# EasyEDA schematic Schematic_Transmitter.json
TITLE: Sheet_1; REV: 1.0; Date: 2023-10-30; Sheet: 1/1; Drawn By: sreenupalem; Company: Your Company
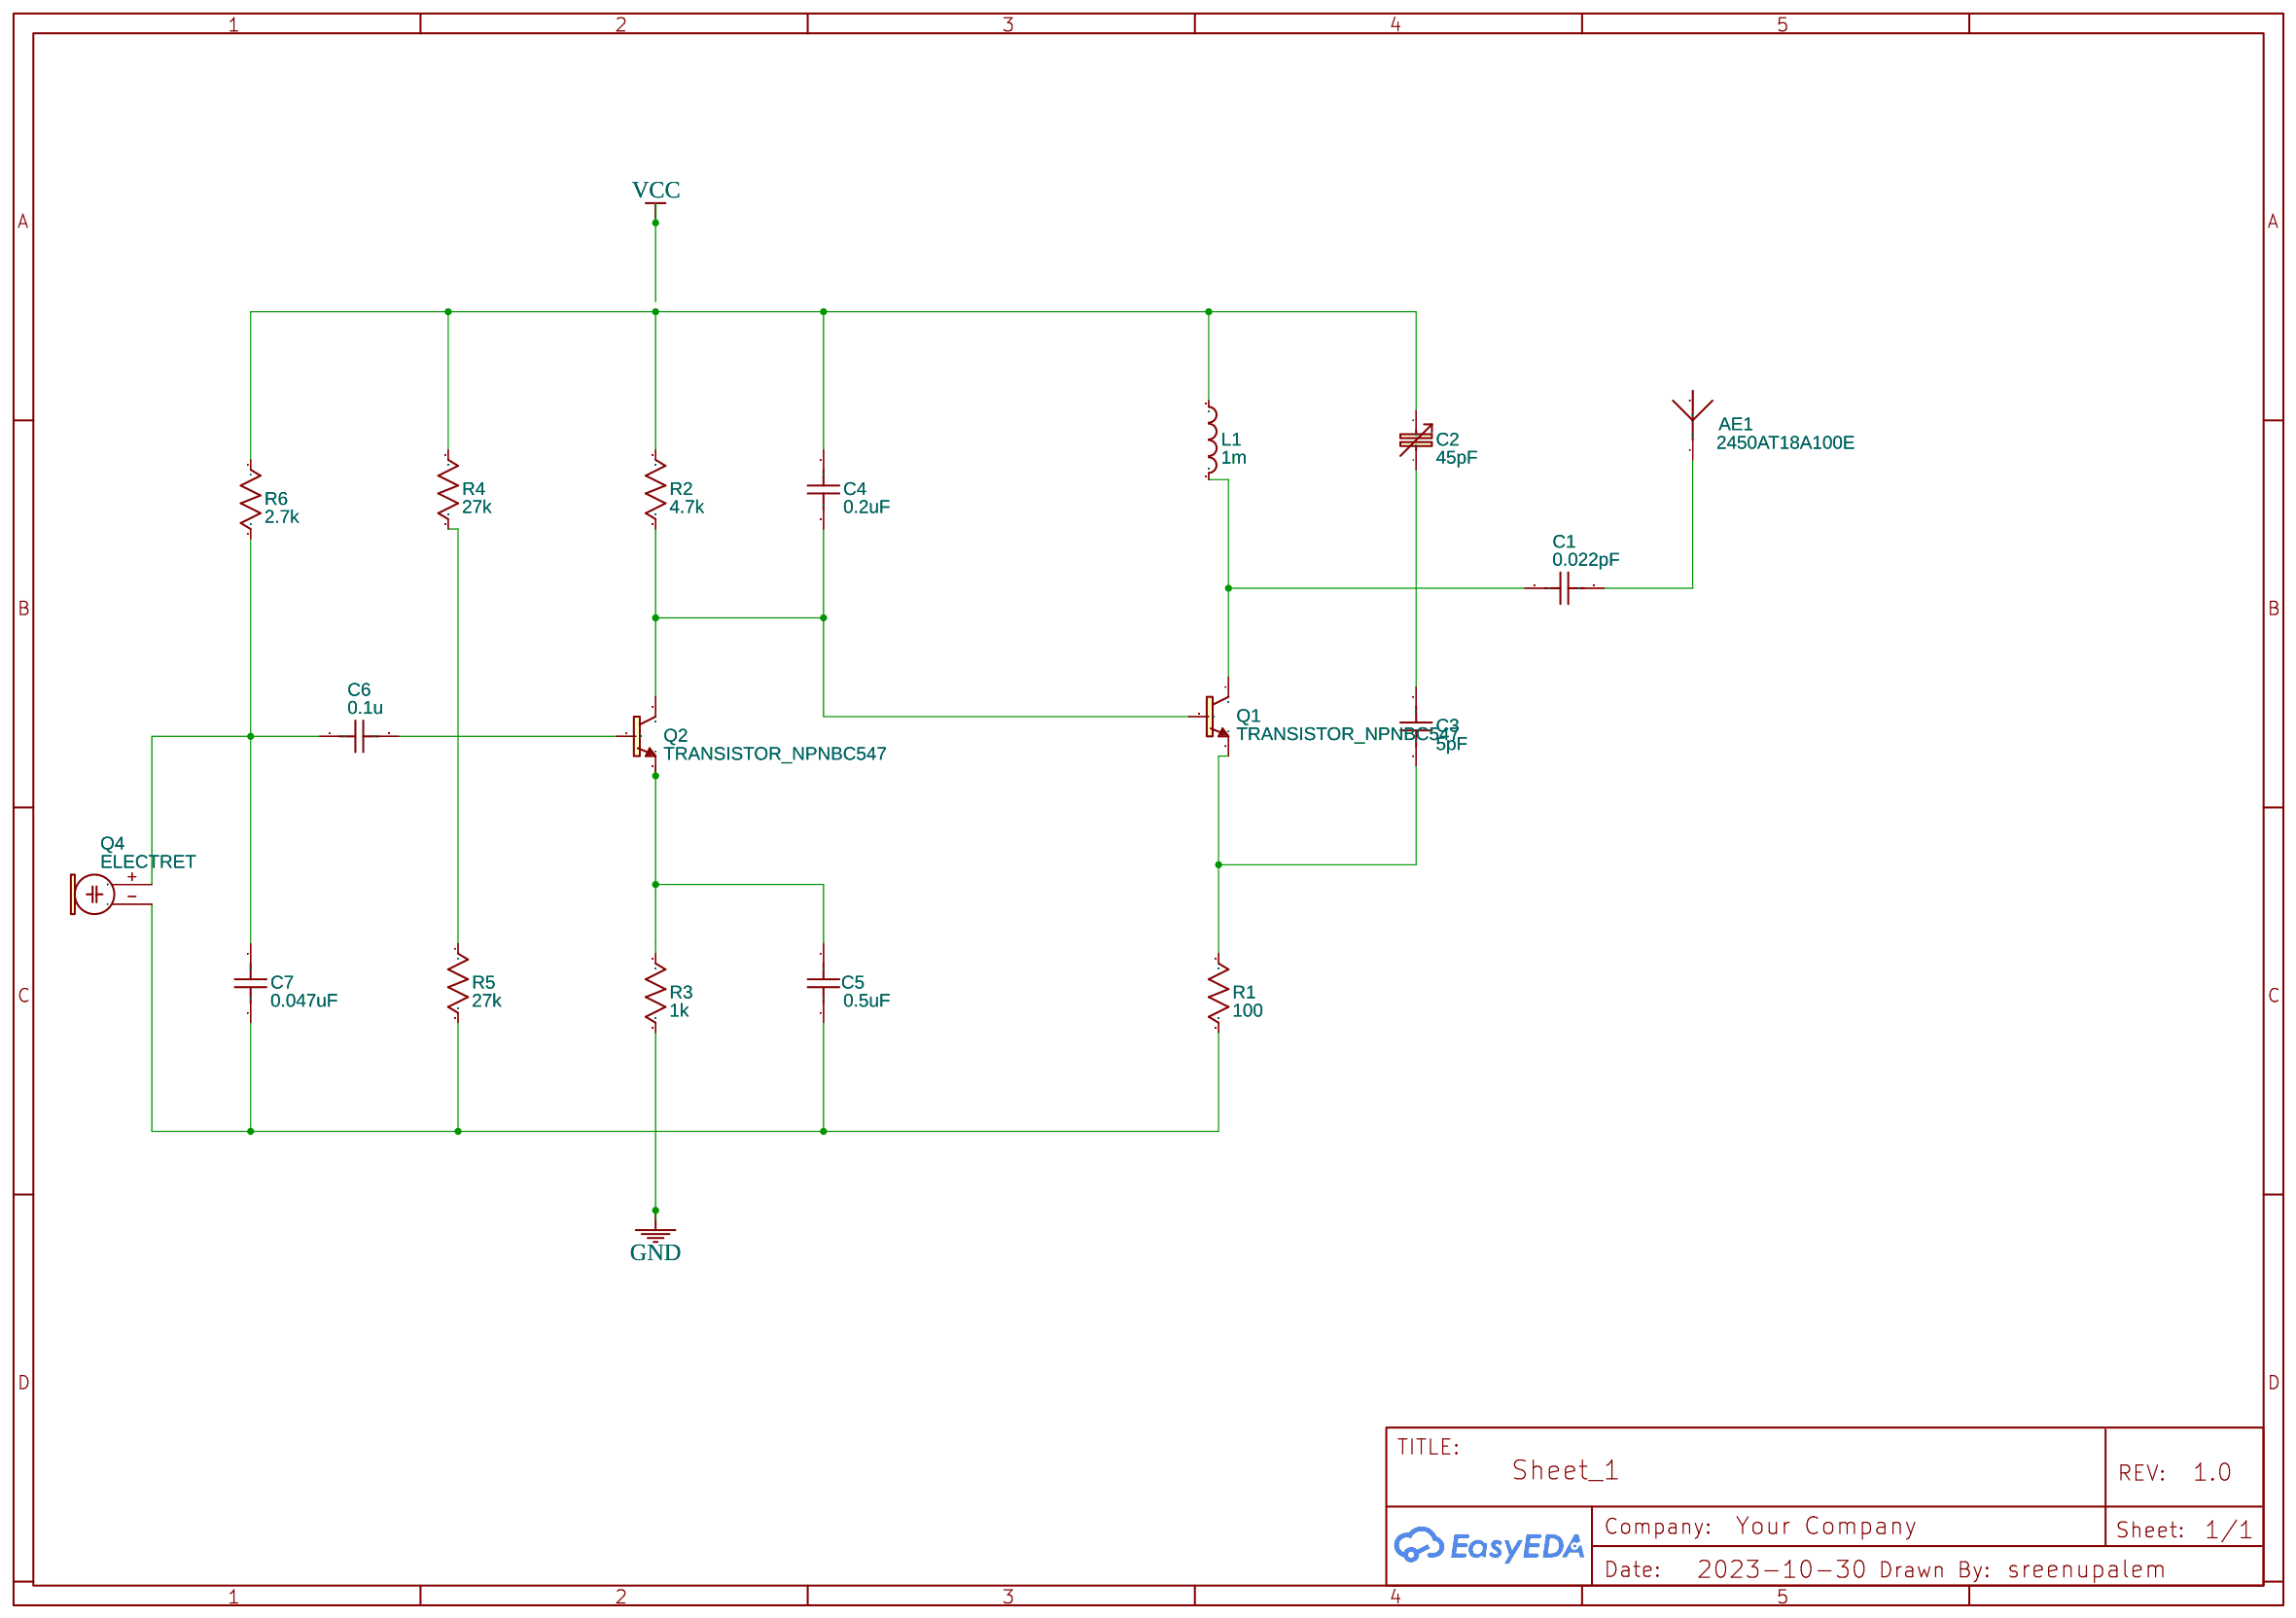
[diagram p0: schematic sheet]

## Parts
AE1  2450AT18A100E  [ANT-SMD_L3.2-W1.6]
C1  0.022pF  [C0603]
C2  45pF  [CTZ3]
C3  5pF  [C0603]
C4  0.2uF  [C0603]
C5  0.5uF  [C0603]
C6  0.1u  [C0603]
C7  0.047uF  [C0603]
L1  1m  [L0603]
Q1  TRANSISTOR_NPNBC547  [TO-92-AMMO]
Q2  TRANSISTOR_NPNBC547  [TO-92-AMMO]
Q4  ELECTRET  [9.7ELECTRET]
R1  100  [R0603]
R2  4.7k  [R0603]
R3  1k  [R0603]
R4  27k  [R0603]
R5  27k  [R0603]
R6  2.7k  [R0603]

## Library data of the parts
AE1 = 2450AT18A100E: Contributor: LCSC; Supplier: LCSC; Supplier Part: C89334; Manufacturer: JOHANSON(约翰逊); JLCPCB Part Class: Extended Part; link: https://lcsc.com/eda_search?q=C89334&%26type=1&ref=editor
C1 C3-C7 = C_0603_US: Contributor: LCEDA_Lib
C2 = CAP_ADJSMD: Variable, non-polarized capacitor; Contributor: SparkFun
L1 = L0603_US: Contributor: LCEDA_Lib
Q1 Q2 = TRANSISTOR_NPNBC547: Generic NPN BJT; Contributor: SparkFun
Q4 = ELECTRET: Contributor: Adafruit
R1-R6 = R_0603_US: Contributor: LCEDA_Lib

## Nets
GND: R3.2
Net-(AE1-1): AE1.1(ANT) C1.2
Net-(C1-1): C1.1 L1.2 Q1.1(C)
Net-(C2-+): C2.+(3) C4.1 L1.1 R2.1 R4.1 R6.1
Net-(C2--): C2.-(4) C3.1
Net-(C3-2): C3.2 Q1.3(E) R1.1
Net-(C4-2): C4.2 Q1.2(B) Q2.1(C) R2.2
Net-(C5-1): C5.1 Q2.3(E) R3.1
Net-(C5-2): C5.2 C7.2 Q4.-(1) R1.2 R5.2
Net-(C6-1): C6.1 C7.1 Q4.+(2) R6.2
Net-(C6-2): C6.2 Q2.2(B)
Net-(R4-2): R4.2 R5.1

Not connected (* = marked no-connect by the designer): AE1 2
